# EAGLE design Dyno (EAGLE 9.6.2)
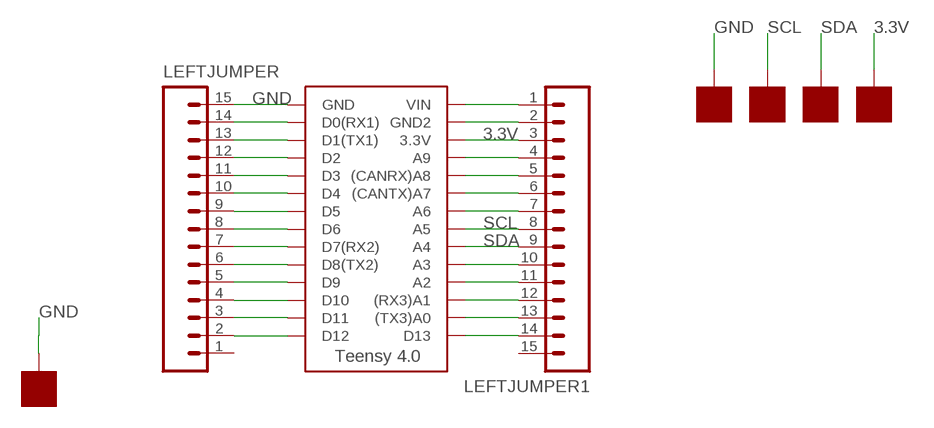
[diagram p0: schematic, sheet 1]

## Parts
GND1  SOLDER_PAD  [SOLDER_PAD_XSMALL]
LEDGND  SOLDER_PAD  [SOLDER_PAD_XSMALL]
LEFTJUMPER  M15  [1X15]
LEFTJUMPER1  M15  [1X15]
SCL  SOLDER_PAD  [SOLDER_PAD_XSMALL]
SDA  SOLDER_PAD  [SOLDER_PAD_XSMALL]
U$1  TEENSY_4.0_SIMPLE  [TEENSY_4.0_SIMPLE]
VCC  SOLDER_PAD  [SOLDER_PAD_XSMALL]

## Nets
3.3V: LEFTJUMPER1.3 U$1.3.3V VCC.P$1
GND: GND1.P$1 LEDGND.P$1 LEFTJUMPER1.2 LEFTJUMPER.15 U$1.GND U$1.GND2
N$1: LEFTJUMPER1.1 U$1.VIN
N$3: LEFTJUMPER.14 U$1.D0(RX1)
N$4: LEFTJUMPER.13 U$1.D1(TX1)
N$5: LEFTJUMPER.12 U$1.D2
N$6: LEFTJUMPER.11 U$1.D3
N$7: LEFTJUMPER.10 U$1.D4
N$8: LEFTJUMPER.9 U$1.D5
N$9: LEFTJUMPER.8 U$1.D6
N$10: LEFTJUMPER.7 U$1.D7(RX2)
N$11: LEFTJUMPER.6 U$1.D8(TX2)
N$12: LEFTJUMPER.5 U$1.D9
N$13: LEFTJUMPER.4 U$1.D10
N$14: LEFTJUMPER.3 U$1.D11
N$15: LEFTJUMPER.2 U$1.D12
N$17: LEFTJUMPER1.4 U$1.A9
N$18: LEFTJUMPER1.5 U$1.(CANRX)A8
N$19: LEFTJUMPER1.6 U$1.(CANTX)A7
N$20: LEFTJUMPER1.7 U$1.A6
N$23: LEFTJUMPER1.10 U$1.A3
N$24: LEFTJUMPER1.11 U$1.A2
N$25: LEFTJUMPER1.12 U$1.(RX3)A1
N$26: LEFTJUMPER1.13 U$1.(TX3)A0
N$27: LEFTJUMPER1.14 U$1.D13
SCL: LEFTJUMPER1.8 SCL.P$1 U$1.A5
SDA: LEFTJUMPER1.9 SDA.P$1 U$1.A4
Unconnected: LEFTJUMPER1.15 LEFTJUMPER.1

## Library data of the parts
GND1 LEDGND SCL SDA VCC = HyTechDevices:SOLDER_PAD: Solder pad used to attach wires directly to PCB
LEFTJUMPER LEFTJUMPER1 = HyTechDevices:M15: 1x15 .1" header Source: Sparkfun <https://github.com/sparkfun/SparkFun-Eagle-Libraries>
U$1 = HyTechDevices:TEENSY_4.0_SIMPLE: Simple version of the Teensy 4.0 board that only uses the 2 main rows of pins, with no perpendicular row with VBat.

## Board
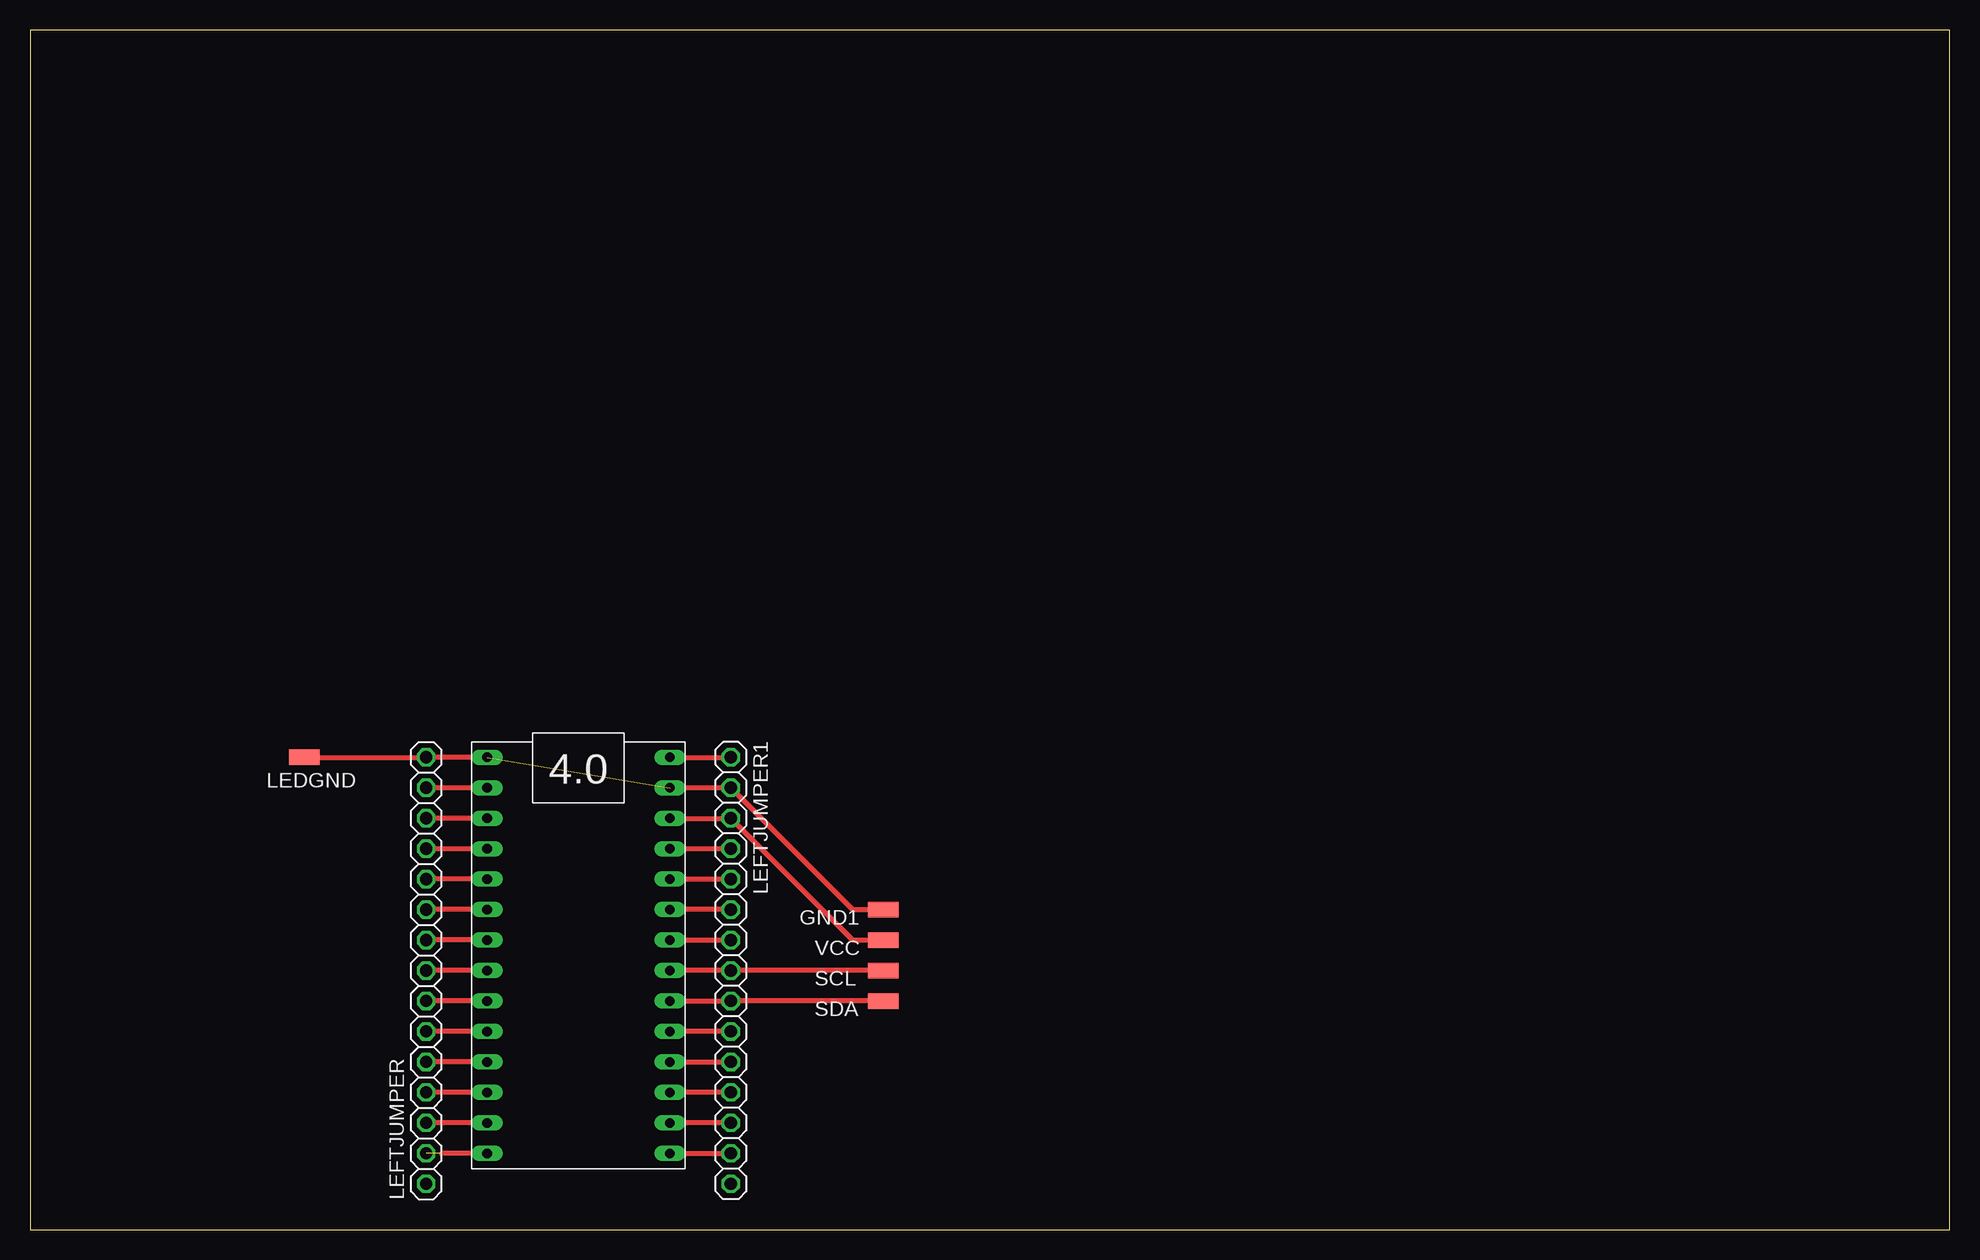
[diagram p1: board, top side]

Size 160 x 100 mm. Coordinates in mm from the lower left corner, seen from the top.
Outline: 0,0 160,0 160,100 0,100 0,0
Copper layers (1*16): Top 0.035mm / dielectric 1.5mm / Bottom 0.035mm
Design rules "default": minimum track width 6mil, minimum drill 0.35mm, track to track 6mil, track to pad 6mil, pad to pad 6mil, via to via 6mil, smd to smd 6mil, copper to edge 40mil, drill to drill 6mil, minimum pad ring 10mil, minimum via ring 8mil, stop-mask expansion 4mil, vias tented up to drill 0mil, thermal gap 10mil

### Footprints (pad centres in the part's own frame; a part is rotated, then mirrored left to right if it is on the bottom)
SOLDER_PAD_XSMALL = smd 2.54 x 1.27: P$1 0,0
1X15 = drill 1.016 octagon: 1 0,0; 2 2.54,0; 3 5.08,0; 4 7.62,0; 5 10.16,0; 6 12.7,0; 7 15.24,0; 8 17.78,0; 9 20.32,0; 10 22.86,0; 11 25.4,0; 12 27.94,0; 13 30.48,0; 14 33.02,0; 15 35.56,0
TEENSY_4.0_SIMPLE = drill 0.8 long: 3.3V 16.51,29.21; (CANRX)A8 16.51,24.13; (CANTX)A7 16.51,21.59; (RX3)A1 16.51,6.35; (TX3)A0 16.51,3.81; A2 16.51,8.89; A3 16.51,11.43; A4 16.51,13.97; A5 16.51,16.51; A6 16.51,19.05; A9 16.51,26.67; D0(RX1) 1.27,31.75; D1(TX1) 1.27,29.21; D2 1.27,26.67; D3 1.27,24.13; D4 1.27,21.59; D5 1.27,19.05; D6 1.27,16.51; D7(RX2) 1.27,13.97; D8(TX2) 1.27,11.43; D9 1.27,8.89; D10 1.27,6.35; D11 1.27,3.81; D12 1.27,1.27; D13 16.51,1.27; GND 1.27,34.29; GND2 16.51,31.75; VIN 16.51,34.29

### Placement (x,y rotation side)
GND1  71.12,26.67 0 top
LEDGND  22.86,39.37 0 top
LEFTJUMPER  33.02,3.81 90 top
LEFTJUMPER1  58.42,39.37 270 top
SCL  71.12,21.59 0 top
SDA  71.12,19.05 0 top
U$1  36.83,5.08 0 top
VCC  71.12,24.13 0 top

### Tracks (layer width: path | path; a pad name or v marks a point on that pad's centre or on a via)
3.3V
  Top 0.406: U$1.3.3V LEFTJUMPER1.3 68.58,24.13 VCC.P$1
GND  (1 unrouted)
  Top 0.406: U$1.GND LEFTJUMPER.15 LEDGND.P$1 | U$1.GND2 LEFTJUMPER1.2 68.58,26.67 GND1.P$1
N$1
  Top 0.406: U$1.VIN LEFTJUMPER1.1
N$3
  Top 0.406: U$1.D0(RX1) LEFTJUMPER.14
N$4
  Top 0.406: U$1.D1(TX1) LEFTJUMPER.13
N$5
  Top 0.406: U$1.D2 LEFTJUMPER.12
N$6
  Top 0.406: U$1.D3 LEFTJUMPER.11
N$7
  Top 0.406: U$1.D4 LEFTJUMPER.10
N$8
  Top 0.406: U$1.D5 LEFTJUMPER.9
N$9
  Top 0.406: U$1.D6 LEFTJUMPER.8
N$10
  Top 0.406: U$1.D7(RX2) LEFTJUMPER.7
N$11
  Top 0.406: U$1.D8(TX2) LEFTJUMPER.6
N$12
  Top 0.406: U$1.D9 LEFTJUMPER.5
N$13
  Top 0.406: U$1.D10 LEFTJUMPER.4
N$14
  Top 0.406: U$1.D11 LEFTJUMPER.3
N$15  (1 unrouted)
  Top 0.406: U$1.D12 34.29,6.35
N$17
  Top 0.406: LEFTJUMPER1.4 U$1.A9
N$18
  Top 0.406: U$1.(CANRX)A8 LEFTJUMPER1.5
N$19
  Top 0.406: LEFTJUMPER1.6 U$1.(CANTX)A7
N$20
  Top 0.406: U$1.A6 LEFTJUMPER1.7
N$23
  Top 0.406: LEFTJUMPER1.10 U$1.A3
N$24
  Top 0.406: U$1.A2 LEFTJUMPER1.11
N$25
  Top 0.406: LEFTJUMPER1.12 U$1.(RX3)A1
N$26
  Top 0.406: LEFTJUMPER1.13 U$1.(TX3)A0
N$27
  Top 0.406: U$1.D13 LEFTJUMPER1.14
SCL
  Top 0.406: U$1.A5 LEFTJUMPER1.8 SCL.P$1
SDA
  Top 0.406: U$1.A4 LEFTJUMPER1.9 SDA.P$1